# Altium schematic sheet HW_SCH.SchDoc
size A3
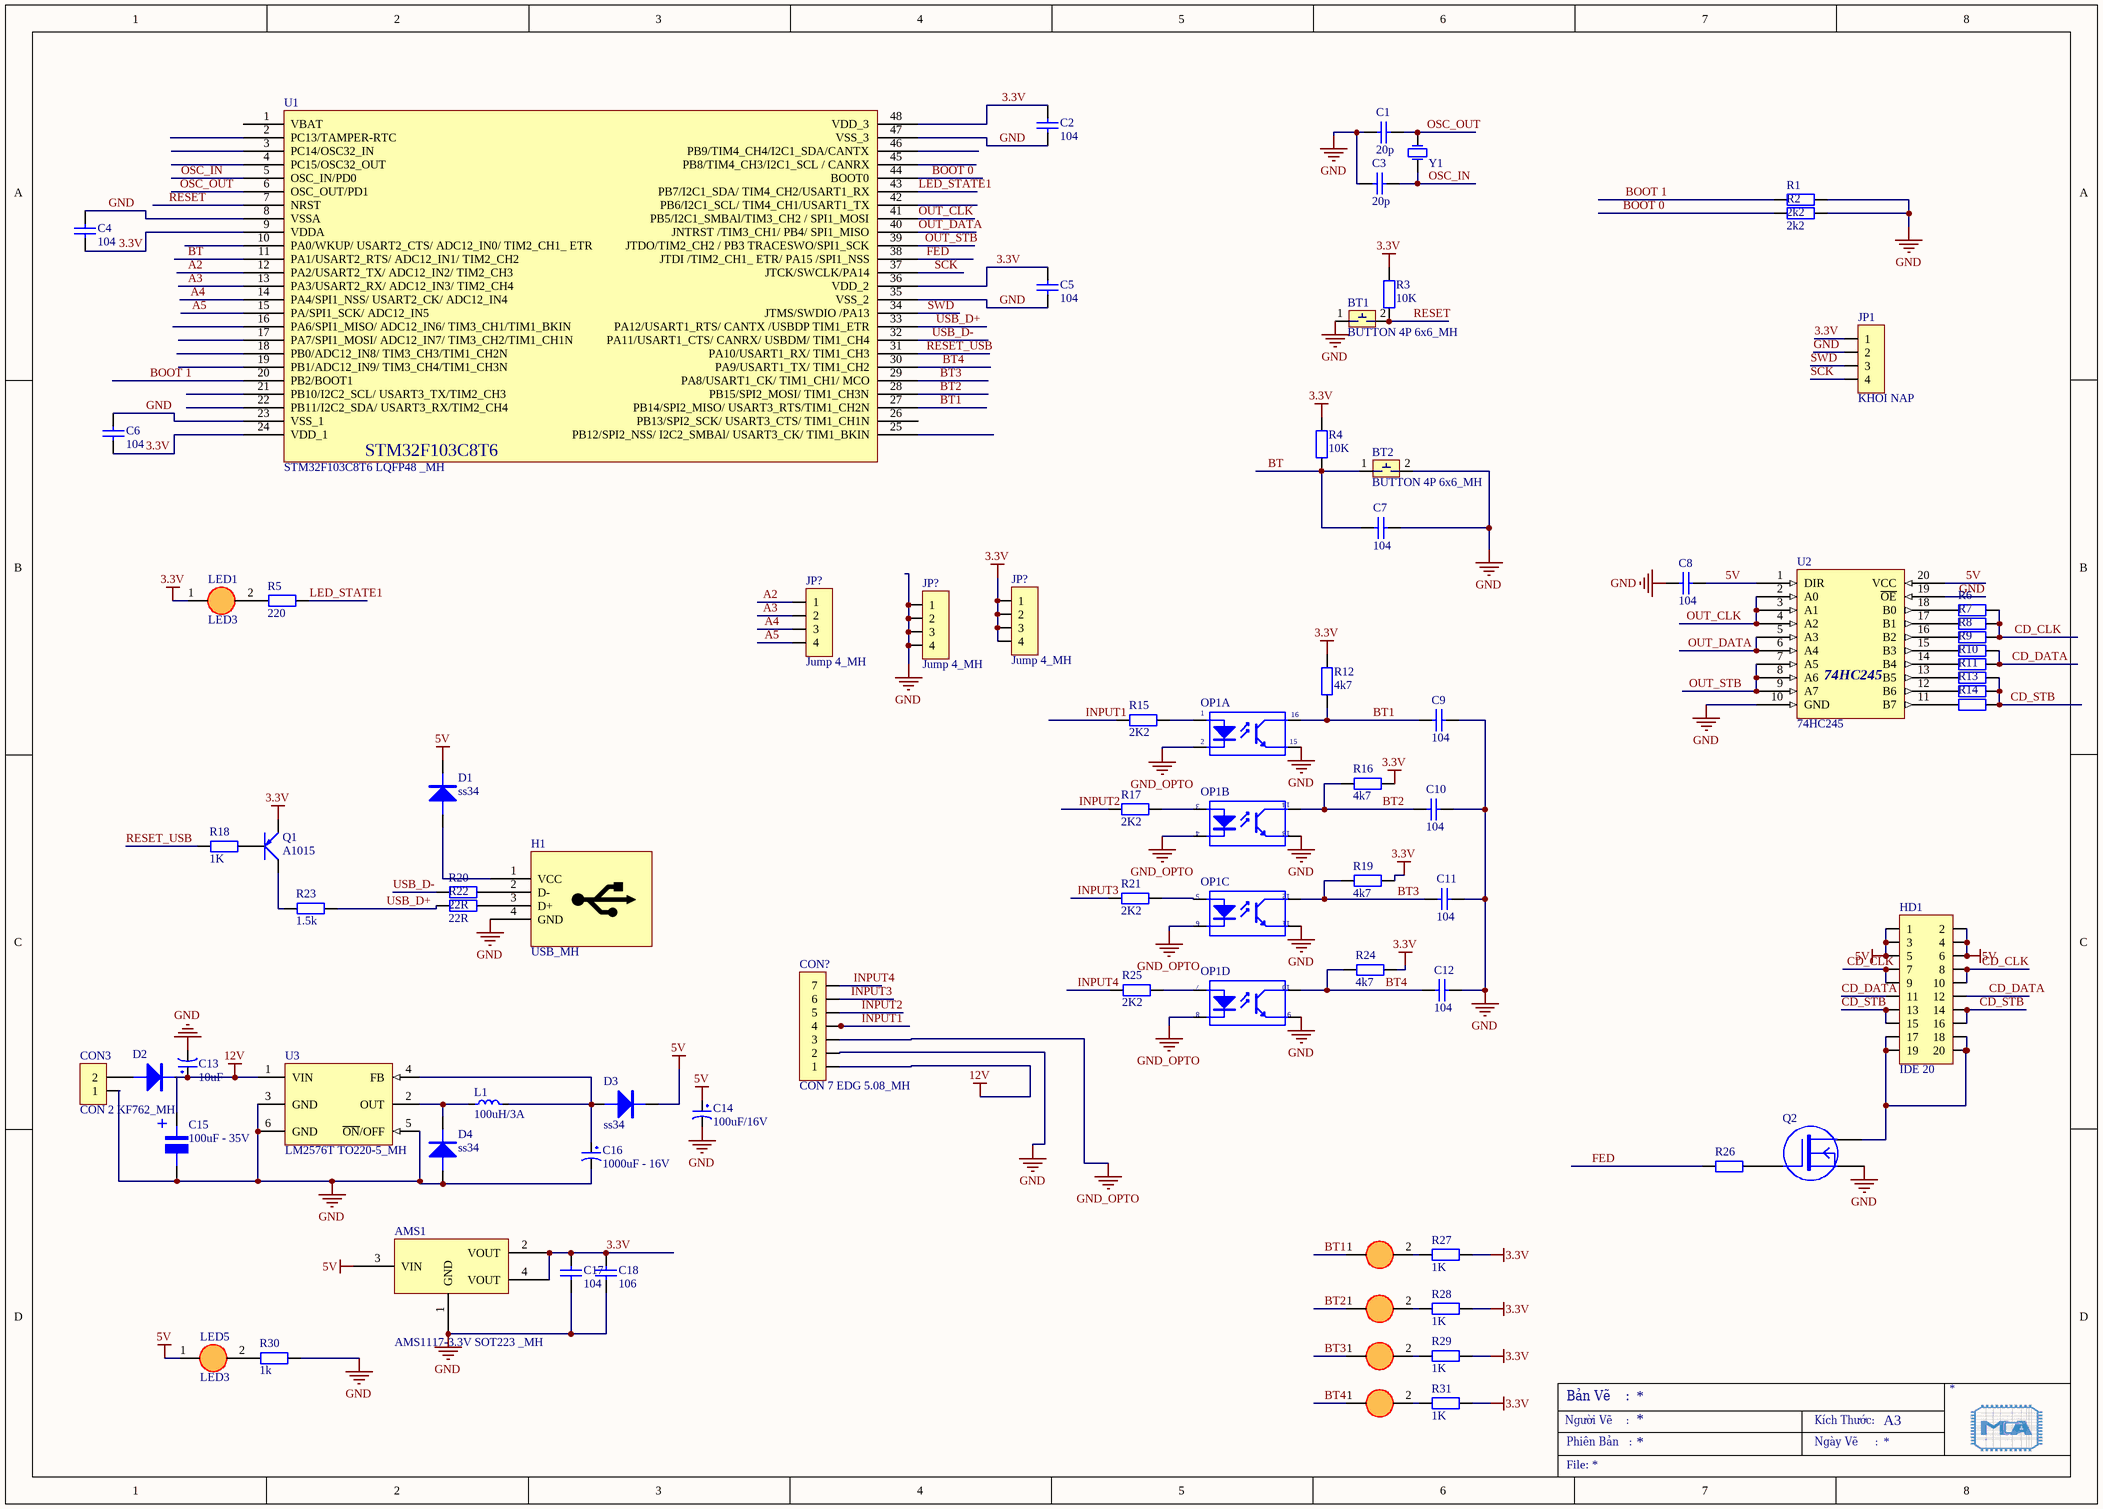
[diagram p0: HW_SCH.SchDoc]

## Parts
(Parts that share a designator on the sheet are numbered #1, #2 ... from top to bottom, then left to right.)
AMS1  AMS1117-3.3V SOT223 _MH  [SOT223]
BT1  BUTTON 4P 6x6_MH  [BUTTON 4 PIN(6*6)]
BT2  BUTTON 4P 6x6_MH  [BUTTON 4 PIN(6*6)]
C1  20p  [TU_SMD_0805]
C2  104  [TU_SMD_0805]
C3  20p  [TU_SMD_0805]
C4  104  [TU_SMD_0805]
C5  104  [TU_SMD_0805]
C6  104  [TU_SMD_0805]
C7  104  [TU_SMD_0805]
C8  104  [TU_SMD_0805]
C9  104  [TU_SMD_0805]
C10  104  [TU_SMD_0805]
C11  104  [TU_SMD_0805]
C12  104  [TU_SMD_0805]
C13  10uF  [CP2/5]
C14  100uF/16V  [TU_HOA(100uF/35V - 470uF/16V)]
C15  100uF - 35V  [TU HOA 8mm]
C16  1000uF - 16V  [TU HOA 1000uF25V]
C17  104  [TU_SMD_0805]
C18  106  [TU_SMD_0805]
CON3  CON 2 KF762_MH  [Con 2 KF762]
CON?  CON 7 EDG 5.08_MH  [Con 7 EDG 5.08]
D1  ss34  [SS14]
D2  Diode 1N4001 DO41 1A 50V (DIP)_MH  [SS14]  (value not drawn)
D3  ss34  [SS14]
D4  ss34  [SS14]
H1  USB_MH  [USB-B-STRANGE]
HD1  IDE 20  [CABLE 20]
JP1  KHOI NAP  [Jump 4]
JP?#1  Jump 4_MH  [Jump 4]
JP?#2  Jump 4_MH  [Jump 4]
JP?#3  Jump 4_MH  [Jump 4]
L1  100uH/3A  [L100uH3A]
LED1  LED3  [LED 3mm Do]
LED2  LED3  [LED 3mm Do]  (value not drawn)
LED3  LED3  [LED 3mm Do]  (value not drawn)
LED4  LED3  [LED 3mm Do]  (value not drawn)
LED5  LED3  [LED 3mm Do]
LED6  LED3  [LED 3mm Do]  (value not drawn)
OP1  TLP521-4GB DIP16 _MH  [DIP16]  (value not drawn)  (parts A,B,C,D of 4)
Q1  A1015  [SOT23]
Q2  IRF540N TO220 MOSFET N-CH 28A 100V_MH  [G_D_S_TO220]  (value not drawn)
R1  2k2  [TRO_VACH_ 1/4W]
R2  2k2  [TRO_VACH_ 1/4W]
R3  10K  [TRO_VACH_ 1/4W]
R4  10K  [Tro SMD 0805]
R5  220  [Tro SMD 0805]
R6  220  [Tro SMD 0805]  (value not drawn)
R7  220  [Tro SMD 0805]  (value not drawn)
R8  220  [Tro SMD 0805]  (value not drawn)
R9  220  [Tro SMD 0805]  (value not drawn)
R10  220  [Tro SMD 0805]  (value not drawn)
R11  220  [Tro SMD 0805]  (value not drawn)
R12  4k7  [Tro SMD 0805]
R13  220  [Tro SMD 0805]  (value not drawn)
R14  220  [Tro SMD 0805]  (value not drawn)
R15  2K2  [Tro SMD 0805]
R16  4k7  [Tro SMD 0805]
R17  2K2  [Tro SMD 0805]
R18  1K  [TRO_VACH_ 1/4W]
R19  4k7  [Tro SMD 0805]
R20  22R  [Tro SMD 0805]
R21  2K2  [Tro SMD 0805]
R22  22R  [Tro SMD 0805]
R23  1.5k  [TRO_VACH_ 1/4W]
R24  4k7  [Tro SMD 0805]
R25  2K2  [Tro SMD 0805]
R26  220  [Tro SMD 0805]  (value not drawn)
R27  1K  [Tro SMD 0805]
R28  1K  [Tro SMD 0805]
R29  1K  [Tro SMD 0805]
R30  1k  [Tro SMD 0805]
R31  1K  [Tro SMD 0805]
U1  STM32F103C8T6 LQFP48 _MH  [48A_M]
U2  74HC245  [dip20]
U3  LM2576T TO220-5_MH  [LM2576t]
Y1  8Mhz  [XT2]  (value not drawn)

## Nets
3.3V: AMS1.2(VOUT) AMS1.4(VOUT) C2.1 C4.1 C5.1 C6.1 C17.2 C18.2 JP1.1 JP?#2.1 JP?#2.2 JP?#2.3 JP?#2.4 LED1.1(A) Q1.2(E) R3.2 R4.2 R12.2 R16.2 R19.2 R24.2 R27.2 R28.2 R29.2 R31.2 U1.9(VDDA) U1.24(VDD_1) U1.36(VDD_2) U1.48(VDD_3)
5V: AMS1.3(VIN) C8.1 C14.1 D1.2 D3.2 HD1.1 HD1.2 HD1.3 HD1.4 HD1.5 HD1.6 LED5.1(A) U2.1(DIR) U2.20(VCC)
12V: C13.1 C15.1 CON?.1 D2.2 U3.1(VIN)
GND: AMS1.1(GND) BT1.1 BT2.2 C1.2 C2.2 C3.2 C4.2 C5.2 C6.2 C7.2 C8.2 C9.1 C10.1 C11.1 C12.1 C13.2 C14.2 C15.2 C16.2 C17.1 C18.1 CON3.1 CON?.2 D4.1 H1.4(GND) JP1.2 JP?#3.1 JP?#3.2 JP?#3.3 JP?#3.4 OP1.9(E) OP1.11(E) OP1.13(E) OP1.15(E) Q2.3(S) R1.1 R2.1 R30.1 U1.8(VSSA) U1.23(VSS_1) U1.35(VSS_2) U1.47(VSS_3) U2.10(GND) U2.19(~{OE}) U3.3(GND) U3.5(~{ON}/OFF) U3.6(GND)
GND_OPTO: CON?.3 OP1.2(K) OP1.4(K) OP1.6(K) OP1.8(K)
A2: JP?#1.1 U1.12(PA2/USART2_TX/_ADC12_IN2/_TIM2_CH3)
A3: JP?#1.2 U1.13(PA3/USART2_RX/_ADC12_IN3/_TIM2_CH4)
A4: JP?#1.3 U1.14(PA4/SPI1_NSS/_USART2_CK/_ADC12_IN4)
A5: JP?#1.4 U1.15(PA/SPI1_SCK/_ADC12_IN5)
BOOT 0: R2.2 U1.44(BOOT0)
BOOT 1: R1.2 U1.20(PB2/BOOT1)
BT: BT2.1 C7.1 R4.1 U1.11(PA1/USART2_RTS/_ADC12_IN1/_TIM2_CH2)
BT1: C9.2 LED2.1(A) OP1.16(C) R12.1 U1.27(PB14/SPI2_MISO/_USART3_RTS/TIM1_CH2N)
BT2: C10.2 LED3.1(A) OP1.14(C) R16.1 U1.28(PB15/SPI2_MOSI/_TIM1_CH3N)
BT3: C11.2 LED4.1(A) OP1.12(C) R19.1 U1.29(PA8/USART1_CK/_TIM1_CH1/_MCO)
BT4: C12.2 LED6.1(A) OP1.10(C) R24.1 U1.30(PA9/USART1_TX/_TIM1_CH2)
CD_CLK: HD1.7 HD1.8 HD1.9 HD1.10 R6.1 R7.1 R8.1
CD_DATA: HD1.11 HD1.12 R9.1 R10.1
CD_STB: HD1.13 HD1.14 HD1.15 HD1.16 R11.1 R13.1 R14.1
FED: R26.2 U1.38(JTDI_/TIM2_CH1__ETR/_PA15_/SPI1_NSS)
INPUT1: CON?.4 R15.1
INPUT2: CON?.5 R17.1
INPUT3: CON?.6 R21.1
INPUT4: CON?.7 R25.1
LED_STATE1: R5.2 U1.43(PB7/I2C1_SDA/_TIM4_CH2/USART1_RX)
OSC_IN: C3.1 U1.5(OSC_IN/PD0) Y1.1(OSC1)
OSC_OUT: C1.1 U1.6(OSC_OUT/PD1) Y1.2(OSC2)
OUT_CLK: U1.41(PB5/I2C1_SMBAl/TIM3_CH2_/_SPI1_MOSI) U2.2(A0) U2.3(A1) U2.4(A2)
OUT_DATA: U1.40(JNTRST_/TIM3_CH1/_PB4/_SPI1_MISO) U2.5(A3) U2.6(A4)
OUT_STB: U1.39(JTDO/TIM2_CH2_/_PB3_TRACESWO/SPI1_SCK) U2.7(A5) U2.8(A6) U2.9(A7)
RESET: BT1.2 R3.1 U1.7(NRST)
RESET_USB: R18.1 U1.31(PA10/USART1_RX/_TIM1_CH3)
SCK: JP1.4 U1.37(JTCK/SWCLK/PA14)
SWD: JP1.3 U1.34(JTMS/SWDIO_/PA13)
USB_D+: R22.1 R23.2 U1.33(PA12/USART1_RTS/_CANTX_/USBDP_TIM1_ETR)
USB_D-: R20.1 U1.32(PA11/USART1_CTS/_CANRX/_USBDM/_TIM1_CH4)
NetC16_1: C16.1 D3.1 L1.2 U3.4(FB)
NetCON3_2: CON3.2 D2.1
NetD1_1: D1.1 H1.1(VCC)
NetD4_2: D4.2 L1.1 U3.2(OUT)
NetH1_2: H1.2(D-) R20.2
NetH1_3: H1.3(D+) R22.2
NetHD1_17: HD1.17 HD1.18 HD1.19 HD1.20 Q2.2(D)
NetLED1_2: LED1.2(K) R5.1
NetLED2_2: LED2.2(K) R27.1
NetLED3_2: LED3.2(K) R28.1
NetLED4_2: LED4.2(K) R29.1
NetLED5_2: LED5.2(K) R30.2
NetLED6_2: LED6.2(K) R31.1
NetOP1_1: OP1.1(A) R15.2
NetOP1_3: OP1.3(A) R17.2
NetOP1_5: OP1.5(A) R21.2
NetOP1_7: OP1.7(A) R25.2
NetQ1_1: Q1.1(B) R18.2
NetQ1_3: Q1.3(C) R23.1
NetQ2_1: Q2.1(G) R26.1
NetR6_2: R6.2 U2.18(B0)
NetR7_2: R7.2 U2.17(B1)
NetR8_2: R8.2 U2.16(B2)
NetR9_2: R9.2 U2.15(B3)
NetR10_2: R10.2 U2.14(B4)
NetR11_2: R11.2 U2.13(B5)
NetR13_2: R13.2 U2.12(B6)
NetR14_2: R14.2 U2.11(B7)

Not connected (* = marked no-connect by the designer): H1 5 6; U1 1(VBAT) 2(PC13/TAMPER-RTC) 3(PC14/OSC32_IN) 4(PC15/OSC32_OUT) 10(PA0/WKUP/_USART2_CTS/_ADC12_IN0/_TIM2_CH1__ETR) 16(PA6/SPI1_MISO/_ADC12_IN6/_TIM3_CH1/TIM1_BKIN) 17(PA7/SPI1_MOSI/_ADC12_IN7/_TIM3_CH2/TIM1_CH1N) 18(PB0/ADC12_IN8/_TIM3_CH3/TIM1_CH2N) 19(PB1/ADC12_IN9/_TIM3_CH4/TIM1_CH3N) 21(PB10/I2C2_SCL/_USART3_TX/TIM2_CH3) 22(PB11/I2C2_SDA/_USART3_RX/TIM2_CH4) 25(PB12/SPI2_NSS/_I2C2_SMBAl/_USART3_CK/_TIM1_BKIN) 26(PB13/SPI2_SCK/_USART3_CTS/_TIM1_CH1N) 42(PB6/I2C1_SCL/_TIM4_CH1/USART1_TX) 45(PB8/TIM4_CH3/I2C1_SCL_/_CANRX) 46(PB9/TIM4_CH4/I2C1_SDA/CANTX)

## Notes on the sheet
- Người Vẽ    :
- Phiên Bản   :
- Bản Vẽ    :
- Kích Thước:
- Ngày Vẽ     :
- A3
- File:
- (in symbol STM32F103C8T6 LQFP48 _MH) STM32F103C8T6
- (in symbol Tu Hoa 100uF 35V) +

## Library data of the parts
BT1 BT2 = BUTTON 4P 6x6_MH: Nút nhấn 4 chân, 6x6mm, cắm
C1-C12 C17 C18 = TU_SMD_0805_MH
C13 = TU_HOA_47uF_100V_MH: Value: 10uF/50V; Description 1: 10 => 220uF/6,3V/10V - 10uF => 100uF/16V; Description 2: 0,1uF => 33uF/50V - 10uF => 22uF/63V; Description 3: 0,47uF => 10uF/100V
C14 = TU_HOA_100uF_16V_MH: TU_HOA_100uF_16V; Value: 100uF/35V/50V; Description 1: 1000uF/6,3V - 470uF/16V - 330uF - 25V; Description 2: 220uF/35V - 100uF/50V - 63V - 4,7uF/200V; Description 3: 22uF => 33uF100V - 3,3uF => 4,7uF/250V; Description 4: 2,2uF =>3,3uF/350 - 2,2uF/400V - 1uF/450V
C15 = Tu Hoa 100uF 35V: Cắm; Ten_Linh_Kien: Tụ Hóa 100uF 35V 8x11MM; Ma_Hang: MH002807; Don_Vi: Con; Ghi_Chu: *; Kieu_Chan: *; Chung_Loai: Cắm
C16 = Tu Nhom 1000uF - 16V: Dán; Ten_Linh_Kien: Tụ Nhôm 1000uF 16V 10x10MM; Ma_Hang: MH004419; Don_Vi: Con; Kieu_Chan: *; Ghi_Chu: *; Chung_Loai: Dán
CON3 = CON 2 KF762_MH: CON 2 KF762 - 2P 7.62mm
CON? = CON 7 EDG 5.08_MH: CON 7 EDG 5.08 (xanh cong)
D1 D3 D4 = Diode 1N4007 1A_MH: Diode 1N4007 1A
D2 = Diode 1N4001 DO41 1A 50V (DIP)_MH: Diode 1N4001 DO41 1A 50V (DIP)
H1 = USB_MH: USB conector
HD1 = IDE 20: IDE header 20P
JP1 JP?#1-JP?#3 = Jump 4_MH: Jump 4P 2.54
L1 = L100uH3A: Cuon cam
LED1-LED6 = LED 3mm_MH: LED 3mm
Q1 = A1015 SOT23 TRANS PNP 0.15A 50V ( SMD-BA)_MH
R1-R11 R13 R14 R18 R23 R26 = TRO_VACH_1/4W_MH
R12 R15-R17 R19-R22 R24 R25 R27-R31 = TRO_SMD_0805_MH: TRO_SMD_0805
U2 = 74HC245 DIP20_MH
U3 = LM2576T TO220-5_MH: SIMPLE SWITCHER; 3A Step-Down Voltage Regulator; PartNumber: LM2576T-5.0; Manufacturer: National Semiconductor; PackageTopMarking: NSUZXYTT*LM2576T*-5.0 P+; PowerWise: N; FirstPublished: 4-Dec-2008; DatasheetVersion: Aug-2004; PackageVersion: revJ, Jan-1992; PackageReference: T05A; Publisher: Altium Limited; PackageDescription: TO-220, Molded, 5 Lead, Straight; CompType: Switcher; RoHS: O; PinCount: 5; DigiKeyPartNumber: LM2576T-5.0-ND; Code_JEDEC: TO-220-AB; ComponentLink1Description: LM2576 Datasheet; ComponentLink1URL: http://www.national.com/ds/LM/LM2576.pdf; ComponentLink2Description: LM2576 Web Page; ComponentLink2URL: http://www.national.com/pf/LM/LM2576.html; ComponentLink3Description: T05A Package Page; ComponentLink3URL: http://www.national.com/packaging/folders/t05a.html
Y1 = CRYSTAL_49S DIP_MH: Crystal Oscillator; Published: 8-Jun-2000; LatestRevisionDate: 17-Jul-2002; LatestRevisionNote: Re-released for DXP Platform.; PackageReference: R38; Publisher: Altium Limited
OP1 = TLP521-4GB DIP16 _MH: Value: TLP521-4